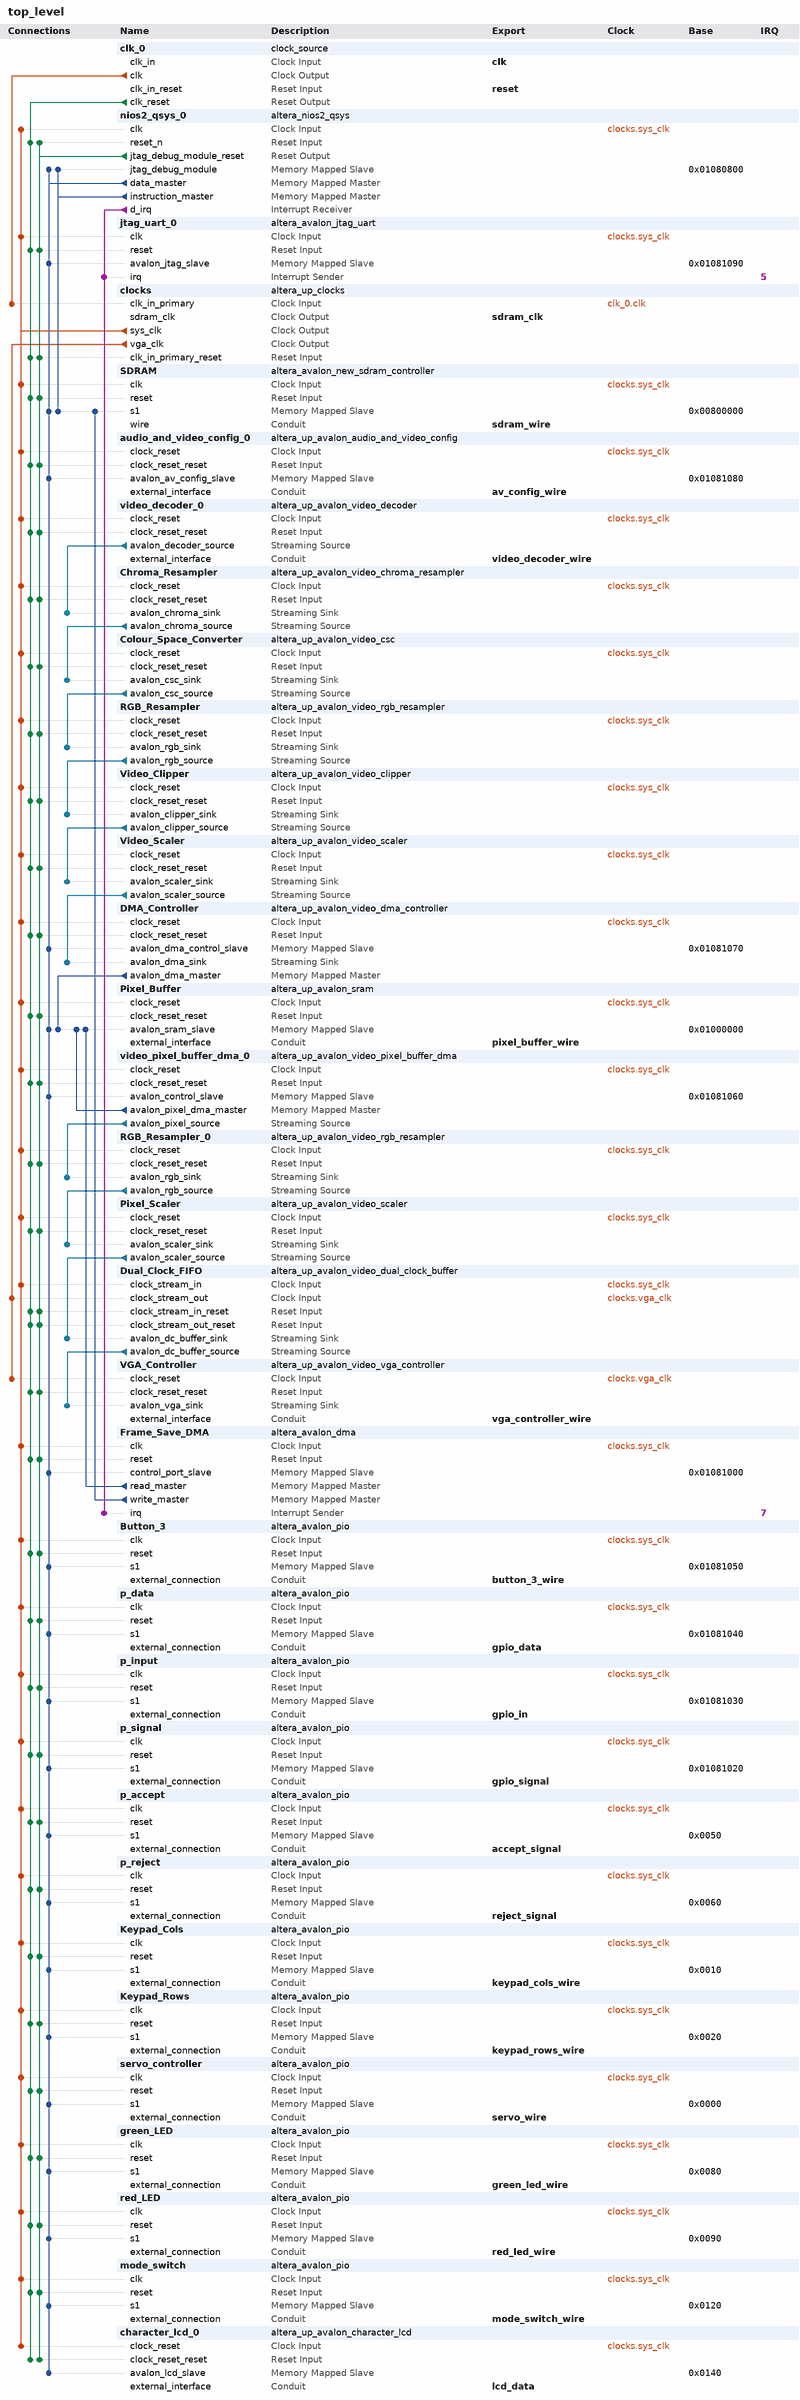
[diagram p0: system contents]
# Platform Designer (Qsys) system top_level, Cyclone II EP2C35F672C6
# Parameters at their usual value, and those the tool derives, are not listed.
package require -exact qsys 13.0
create_system top_level
set_project_property DEVICE_FAMILY {Cyclone II}
set_project_property DEVICE EP2C35F672C6

add_instance clk_0 clock_source 13.0
set_instance_parameter_value clk_0 clockFrequency 50000000

add_instance nios2_qsys_0 altera_nios2_qsys 13.0
set_instance_parameter_value nios2_qsys_0 resetSlave SDRAM.s1
set_instance_parameter_value nios2_qsys_0 mmu_TLBMissExcSlave None
set_instance_parameter_value nios2_qsys_0 exceptionSlave SDRAM.s1
set_instance_parameter_value nios2_qsys_0 breakSlave nios2_qsys_0.jtag_debug_module
set_instance_parameter_value nios2_qsys_0 impl Fast
set_instance_parameter_value nios2_qsys_0 icache_size 4096

add_instance jtag_uart_0 altera_avalon_jtag_uart 13.0.1
set_instance_parameter_value jtag_uart_0 simInteractiveOptions NO_INTERACTIVE_WINDOWS

add_instance clocks altera_up_clocks 13.0
set_instance_parameter_value clocks board DE2
set_instance_parameter_value clocks vga_clk true
set_instance_parameter_value clocks audio_clk false
set_instance_parameter_value clocks audio_clk_freq 12.288

add_instance SDRAM altera_avalon_new_sdram_controller 13.0.1
set_instance_parameter_value SDRAM TAC 5.5
set_instance_parameter_value SDRAM TRCD 20.0
set_instance_parameter_value SDRAM TRP 20.0
set_instance_parameter_value SDRAM casLatency 3
set_instance_parameter_value SDRAM columnWidth 8
set_instance_parameter_value SDRAM dataWidth 16
set_instance_parameter_value SDRAM generateSimulationModel false
set_instance_parameter_value SDRAM model single_Micron_MT48LC4M32B2_7_chip
set_instance_parameter_value SDRAM numberOfBanks 4
set_instance_parameter_value SDRAM numberOfChipSelects 1
set_instance_parameter_value SDRAM powerUpDelay 100.0
set_instance_parameter_value SDRAM refreshPeriod 15.625
set_instance_parameter_value SDRAM rowWidth 12

add_instance audio_and_video_config_0 altera_up_avalon_audio_and_video_config 13.0
set_instance_parameter_value audio_and_video_config_0 board DE2
set_instance_parameter_value audio_and_video_config_0 audio_in {Microphone to ADC}
set_instance_parameter_value audio_and_video_config_0 line_in_bypass false
set_instance_parameter_value audio_and_video_config_0 bit_length 24
set_instance_parameter_value audio_and_video_config_0 sampling_rate {48 kHz}

add_instance video_decoder_0 altera_up_avalon_video_decoder 13.0

add_instance Chroma_Resampler altera_up_avalon_video_chroma_resampler 13.0

add_instance Colour_Space_Converter altera_up_avalon_video_csc 13.0

add_instance RGB_Resampler altera_up_avalon_video_rgb_resampler 13.0
set_instance_parameter_value RGB_Resampler input_type {24-bit RGB}
set_instance_parameter_value RGB_Resampler output_type {16-bit RGB}
set_instance_parameter_value RGB_Resampler alpha 1023

add_instance Video_Clipper altera_up_avalon_video_clipper 13.0
set_instance_parameter_value Video_Clipper color_bits 16
set_instance_parameter_value Video_Clipper color_planes 1

add_instance Video_Scaler altera_up_avalon_video_scaler 13.0
set_instance_parameter_value Video_Scaler width_scaling 0.5
set_instance_parameter_value Video_Scaler height_scaling 1
set_instance_parameter_value Video_Scaler width_in 640
set_instance_parameter_value Video_Scaler color_bits 16
set_instance_parameter_value Video_Scaler color_planes 1

add_instance DMA_Controller altera_up_avalon_video_dma_controller 13.0
set_instance_parameter_value DMA_Controller mode {From Stream to Memory}
set_instance_parameter_value DMA_Controller addr_mode Consecutive
set_instance_parameter_value DMA_Controller start_address 0
set_instance_parameter_value DMA_Controller back_start_address 0
set_instance_parameter_value DMA_Controller width 320
set_instance_parameter_value DMA_Controller height 240
set_instance_parameter_value DMA_Controller color_bits 16
set_instance_parameter_value DMA_Controller color_planes 1
set_instance_parameter_value DMA_Controller dma_enabled true

add_instance Pixel_Buffer altera_up_avalon_sram 13.0
set_instance_parameter_value Pixel_Buffer board DE2
set_instance_parameter_value Pixel_Buffer pixel_buffer true

add_instance video_pixel_buffer_dma_0 altera_up_avalon_video_pixel_buffer_dma 13.0
set_instance_parameter_value video_pixel_buffer_dma_0 addr_mode Consecutive
set_instance_parameter_value video_pixel_buffer_dma_0 start_address 0
set_instance_parameter_value video_pixel_buffer_dma_0 back_start_address 0
set_instance_parameter_value video_pixel_buffer_dma_0 image_width 320
set_instance_parameter_value video_pixel_buffer_dma_0 image_height 240
set_instance_parameter_value video_pixel_buffer_dma_0 color_space {16-bit RGB}

add_instance RGB_Resampler_0 altera_up_avalon_video_rgb_resampler 13.0
set_instance_parameter_value RGB_Resampler_0 input_type {16-bit RGB}
set_instance_parameter_value RGB_Resampler_0 output_type {30-bit RGB}
set_instance_parameter_value RGB_Resampler_0 alpha 1023

add_instance Pixel_Scaler altera_up_avalon_video_scaler 13.0
set_instance_parameter_value Pixel_Scaler width_scaling 2
set_instance_parameter_value Pixel_Scaler height_scaling 2
set_instance_parameter_value Pixel_Scaler width_in 320
set_instance_parameter_value Pixel_Scaler color_bits 10
set_instance_parameter_value Pixel_Scaler color_planes 3

add_instance Dual_Clock_FIFO altera_up_avalon_video_dual_clock_buffer 13.0
set_instance_parameter_value Dual_Clock_FIFO color_bits 10

add_instance VGA_Controller altera_up_avalon_video_vga_controller 13.0
set_instance_parameter_value VGA_Controller board DE2

add_instance Frame_Save_DMA altera_avalon_dma 13.0.1
set_instance_parameter_value Frame_Save_DMA allowByteTransactions true
set_instance_parameter_value Frame_Save_DMA allowDoubleWordTransactions true
set_instance_parameter_value Frame_Save_DMA allowHalfWordTransactions true
set_instance_parameter_value Frame_Save_DMA allowQuadWordTransactions true
set_instance_parameter_value Frame_Save_DMA burstEnable false
set_instance_parameter_value Frame_Save_DMA fifoDepth 32
set_instance_parameter_value Frame_Save_DMA maxBurstSize 128
set_instance_parameter_value Frame_Save_DMA minimumDmaTransactionRegisterWidth 32

add_instance Button_3 altera_avalon_pio 13.0.1
set_instance_parameter_value Button_3 direction Input
set_instance_parameter_value Button_3 width 1

add_instance p_data altera_avalon_pio 13.0.1
set_instance_parameter_value p_data direction Output
set_instance_parameter_value p_data width 8

add_instance p_input altera_avalon_pio 13.0.1
set_instance_parameter_value p_input direction Input
set_instance_parameter_value p_input width 2

add_instance p_signal altera_avalon_pio 13.0.1
set_instance_parameter_value p_signal direction Output
set_instance_parameter_value p_signal width 2

add_instance p_accept altera_avalon_pio 13.0.1
set_instance_parameter_value p_accept direction Input
set_instance_parameter_value p_accept width 1

add_instance p_reject altera_avalon_pio 13.0.1
set_instance_parameter_value p_reject direction Input
set_instance_parameter_value p_reject width 1

add_instance Keypad_Cols altera_avalon_pio 13.0.1
set_instance_parameter_value Keypad_Cols direction Output
set_instance_parameter_value Keypad_Cols width 3

add_instance Keypad_Rows altera_avalon_pio 13.0.1
set_instance_parameter_value Keypad_Rows direction Input
set_instance_parameter_value Keypad_Rows width 4

add_instance servo_controller altera_avalon_pio 13.0.1
set_instance_parameter_value servo_controller direction Output
set_instance_parameter_value servo_controller width 1

add_instance green_LED altera_avalon_pio 13.0.1
set_instance_parameter_value green_LED direction Output
set_instance_parameter_value green_LED width 8

add_instance red_LED altera_avalon_pio 13.0.1
set_instance_parameter_value red_LED direction Output
set_instance_parameter_value red_LED width 18

add_instance mode_switch altera_avalon_pio 13.0.1
set_instance_parameter_value mode_switch direction Input
set_instance_parameter_value mode_switch width 1

add_instance character_lcd_0 altera_up_avalon_character_lcd 13.0
set_instance_parameter_value character_lcd_0 cursor Normal

# connections
add_connection clk_0.clk clocks.clk_in_primary clock
add_connection clocks.sys_clk audio_and_video_config_0.clock_reset clock
add_connection clocks.sys_clk Button_3.clk clock
add_connection clocks.sys_clk character_lcd_0.clock_reset clock
add_connection clocks.sys_clk Chroma_Resampler.clock_reset clock
add_connection clocks.sys_clk Colour_Space_Converter.clock_reset clock
add_connection clocks.sys_clk DMA_Controller.clock_reset clock
add_connection clocks.sys_clk Dual_Clock_FIFO.clock_stream_in clock
add_connection clocks.sys_clk Frame_Save_DMA.clk clock
add_connection clocks.sys_clk green_LED.clk clock
add_connection clocks.sys_clk jtag_uart_0.clk clock
add_connection clocks.sys_clk Keypad_Cols.clk clock
add_connection clocks.sys_clk Keypad_Rows.clk clock
add_connection clocks.sys_clk mode_switch.clk clock
add_connection clocks.sys_clk nios2_qsys_0.clk clock
add_connection clocks.sys_clk p_accept.clk clock
add_connection clocks.sys_clk p_data.clk clock
add_connection clocks.sys_clk p_input.clk clock
add_connection clocks.sys_clk p_reject.clk clock
add_connection clocks.sys_clk p_signal.clk clock
add_connection clocks.sys_clk Pixel_Buffer.clock_reset clock
add_connection clocks.sys_clk Pixel_Scaler.clock_reset clock
add_connection clocks.sys_clk red_LED.clk clock
add_connection clocks.sys_clk RGB_Resampler.clock_reset clock
add_connection clocks.sys_clk RGB_Resampler_0.clock_reset clock
add_connection clocks.sys_clk SDRAM.clk clock
add_connection clocks.sys_clk servo_controller.clk clock
add_connection clocks.sys_clk Video_Clipper.clock_reset clock
add_connection clocks.sys_clk video_decoder_0.clock_reset clock
add_connection clocks.sys_clk video_pixel_buffer_dma_0.clock_reset clock
add_connection clocks.sys_clk Video_Scaler.clock_reset clock
add_connection clocks.vga_clk Dual_Clock_FIFO.clock_stream_out clock
add_connection clocks.vga_clk VGA_Controller.clock_reset clock
add_connection clk_0.clk_reset audio_and_video_config_0.clock_reset_reset reset
add_connection clk_0.clk_reset Button_3.reset reset
add_connection clk_0.clk_reset character_lcd_0.clock_reset_reset reset
add_connection clk_0.clk_reset Chroma_Resampler.clock_reset_reset reset
add_connection clk_0.clk_reset clocks.clk_in_primary_reset reset
add_connection clk_0.clk_reset Colour_Space_Converter.clock_reset_reset reset
add_connection clk_0.clk_reset DMA_Controller.clock_reset_reset reset
add_connection clk_0.clk_reset Dual_Clock_FIFO.clock_stream_in_reset reset
add_connection clk_0.clk_reset Dual_Clock_FIFO.clock_stream_out_reset reset
add_connection clk_0.clk_reset Frame_Save_DMA.reset reset
add_connection clk_0.clk_reset green_LED.reset reset
add_connection clk_0.clk_reset jtag_uart_0.reset reset
add_connection clk_0.clk_reset Keypad_Cols.reset reset
add_connection clk_0.clk_reset Keypad_Rows.reset reset
add_connection clk_0.clk_reset mode_switch.reset reset
add_connection clk_0.clk_reset nios2_qsys_0.reset_n reset
add_connection clk_0.clk_reset p_accept.reset reset
add_connection clk_0.clk_reset p_data.reset reset
add_connection clk_0.clk_reset p_input.reset reset
add_connection clk_0.clk_reset p_reject.reset reset
add_connection clk_0.clk_reset p_signal.reset reset
add_connection clk_0.clk_reset Pixel_Buffer.clock_reset_reset reset
add_connection clk_0.clk_reset Pixel_Scaler.clock_reset_reset reset
add_connection clk_0.clk_reset red_LED.reset reset
add_connection clk_0.clk_reset RGB_Resampler.clock_reset_reset reset
add_connection clk_0.clk_reset RGB_Resampler_0.clock_reset_reset reset
add_connection clk_0.clk_reset SDRAM.reset reset
add_connection clk_0.clk_reset servo_controller.reset reset
add_connection clk_0.clk_reset VGA_Controller.clock_reset_reset reset
add_connection clk_0.clk_reset Video_Clipper.clock_reset_reset reset
add_connection clk_0.clk_reset video_decoder_0.clock_reset_reset reset
add_connection clk_0.clk_reset video_pixel_buffer_dma_0.clock_reset_reset reset
add_connection clk_0.clk_reset Video_Scaler.clock_reset_reset reset
add_connection nios2_qsys_0.jtag_debug_module_reset audio_and_video_config_0.clock_reset_reset reset
add_connection nios2_qsys_0.jtag_debug_module_reset Button_3.reset reset
add_connection nios2_qsys_0.jtag_debug_module_reset character_lcd_0.clock_reset_reset reset
add_connection nios2_qsys_0.jtag_debug_module_reset Chroma_Resampler.clock_reset_reset reset
add_connection nios2_qsys_0.jtag_debug_module_reset clocks.clk_in_primary_reset reset
add_connection nios2_qsys_0.jtag_debug_module_reset Colour_Space_Converter.clock_reset_reset reset
add_connection nios2_qsys_0.jtag_debug_module_reset DMA_Controller.clock_reset_reset reset
add_connection nios2_qsys_0.jtag_debug_module_reset Dual_Clock_FIFO.clock_stream_in_reset reset
add_connection nios2_qsys_0.jtag_debug_module_reset Dual_Clock_FIFO.clock_stream_out_reset reset
add_connection nios2_qsys_0.jtag_debug_module_reset Frame_Save_DMA.reset reset
add_connection nios2_qsys_0.jtag_debug_module_reset green_LED.reset reset
add_connection nios2_qsys_0.jtag_debug_module_reset jtag_uart_0.reset reset
add_connection nios2_qsys_0.jtag_debug_module_reset Keypad_Cols.reset reset
add_connection nios2_qsys_0.jtag_debug_module_reset Keypad_Rows.reset reset
add_connection nios2_qsys_0.jtag_debug_module_reset mode_switch.reset reset
add_connection nios2_qsys_0.jtag_debug_module_reset nios2_qsys_0.reset_n reset
add_connection nios2_qsys_0.jtag_debug_module_reset p_accept.reset reset
add_connection nios2_qsys_0.jtag_debug_module_reset p_data.reset reset
add_connection nios2_qsys_0.jtag_debug_module_reset p_input.reset reset
add_connection nios2_qsys_0.jtag_debug_module_reset p_reject.reset reset
add_connection nios2_qsys_0.jtag_debug_module_reset p_signal.reset reset
add_connection nios2_qsys_0.jtag_debug_module_reset Pixel_Buffer.clock_reset_reset reset
add_connection nios2_qsys_0.jtag_debug_module_reset Pixel_Scaler.clock_reset_reset reset
add_connection nios2_qsys_0.jtag_debug_module_reset red_LED.reset reset
add_connection nios2_qsys_0.jtag_debug_module_reset RGB_Resampler.clock_reset_reset reset
add_connection nios2_qsys_0.jtag_debug_module_reset RGB_Resampler_0.clock_reset_reset reset
add_connection nios2_qsys_0.jtag_debug_module_reset SDRAM.reset reset
add_connection nios2_qsys_0.jtag_debug_module_reset servo_controller.reset reset
add_connection nios2_qsys_0.jtag_debug_module_reset VGA_Controller.clock_reset_reset reset
add_connection nios2_qsys_0.jtag_debug_module_reset Video_Clipper.clock_reset_reset reset
add_connection nios2_qsys_0.jtag_debug_module_reset video_decoder_0.clock_reset_reset reset
add_connection nios2_qsys_0.jtag_debug_module_reset video_pixel_buffer_dma_0.clock_reset_reset reset
add_connection nios2_qsys_0.jtag_debug_module_reset Video_Scaler.clock_reset_reset reset
add_connection DMA_Controller.avalon_dma_master Pixel_Buffer.avalon_sram_slave avalon
set_connection_parameter_value DMA_Controller.avalon_dma_master/Pixel_Buffer.avalon_sram_slave baseAddress 0x01000000
add_connection Frame_Save_DMA.read_master Pixel_Buffer.avalon_sram_slave avalon
set_connection_parameter_value Frame_Save_DMA.read_master/Pixel_Buffer.avalon_sram_slave baseAddress 0x01000000
add_connection Frame_Save_DMA.write_master SDRAM.s1 avalon
set_connection_parameter_value Frame_Save_DMA.write_master/SDRAM.s1 baseAddress 0x00800000
add_connection nios2_qsys_0.data_master audio_and_video_config_0.avalon_av_config_slave avalon
set_connection_parameter_value nios2_qsys_0.data_master/audio_and_video_config_0.avalon_av_config_slave baseAddress 0x01081080
add_connection nios2_qsys_0.data_master Button_3.s1 avalon
set_connection_parameter_value nios2_qsys_0.data_master/Button_3.s1 baseAddress 0x01081050
add_connection nios2_qsys_0.data_master character_lcd_0.avalon_lcd_slave avalon
set_connection_parameter_value nios2_qsys_0.data_master/character_lcd_0.avalon_lcd_slave baseAddress 0x0140
add_connection nios2_qsys_0.data_master DMA_Controller.avalon_dma_control_slave avalon
set_connection_parameter_value nios2_qsys_0.data_master/DMA_Controller.avalon_dma_control_slave baseAddress 0x01081070
add_connection nios2_qsys_0.data_master Frame_Save_DMA.control_port_slave avalon
set_connection_parameter_value nios2_qsys_0.data_master/Frame_Save_DMA.control_port_slave baseAddress 0x01081000
add_connection nios2_qsys_0.data_master green_LED.s1 avalon
set_connection_parameter_value nios2_qsys_0.data_master/green_LED.s1 baseAddress 0x0080
add_connection nios2_qsys_0.data_master jtag_uart_0.avalon_jtag_slave avalon
set_connection_parameter_value nios2_qsys_0.data_master/jtag_uart_0.avalon_jtag_slave baseAddress 0x01081090
add_connection nios2_qsys_0.data_master Keypad_Cols.s1 avalon
set_connection_parameter_value nios2_qsys_0.data_master/Keypad_Cols.s1 baseAddress 0x0010
add_connection nios2_qsys_0.data_master Keypad_Rows.s1 avalon
set_connection_parameter_value nios2_qsys_0.data_master/Keypad_Rows.s1 baseAddress 0x0020
add_connection nios2_qsys_0.data_master mode_switch.s1 avalon
set_connection_parameter_value nios2_qsys_0.data_master/mode_switch.s1 baseAddress 0x0120
add_connection nios2_qsys_0.data_master nios2_qsys_0.jtag_debug_module avalon
set_connection_parameter_value nios2_qsys_0.data_master/nios2_qsys_0.jtag_debug_module baseAddress 0x01080800
add_connection nios2_qsys_0.data_master p_accept.s1 avalon
set_connection_parameter_value nios2_qsys_0.data_master/p_accept.s1 baseAddress 0x0050
add_connection nios2_qsys_0.data_master p_data.s1 avalon
set_connection_parameter_value nios2_qsys_0.data_master/p_data.s1 baseAddress 0x01081040
add_connection nios2_qsys_0.data_master p_input.s1 avalon
set_connection_parameter_value nios2_qsys_0.data_master/p_input.s1 baseAddress 0x01081030
add_connection nios2_qsys_0.data_master p_reject.s1 avalon
set_connection_parameter_value nios2_qsys_0.data_master/p_reject.s1 baseAddress 0x0060
add_connection nios2_qsys_0.data_master p_signal.s1 avalon
set_connection_parameter_value nios2_qsys_0.data_master/p_signal.s1 baseAddress 0x01081020
add_connection nios2_qsys_0.data_master Pixel_Buffer.avalon_sram_slave avalon
set_connection_parameter_value nios2_qsys_0.data_master/Pixel_Buffer.avalon_sram_slave baseAddress 0x01000000
add_connection nios2_qsys_0.data_master red_LED.s1 avalon
set_connection_parameter_value nios2_qsys_0.data_master/red_LED.s1 baseAddress 0x0090
add_connection nios2_qsys_0.data_master SDRAM.s1 avalon
set_connection_parameter_value nios2_qsys_0.data_master/SDRAM.s1 baseAddress 0x00800000
add_connection nios2_qsys_0.data_master servo_controller.s1 avalon
set_connection_parameter_value nios2_qsys_0.data_master/servo_controller.s1 baseAddress 0x0000
add_connection nios2_qsys_0.data_master video_pixel_buffer_dma_0.avalon_control_slave avalon
set_connection_parameter_value nios2_qsys_0.data_master/video_pixel_buffer_dma_0.avalon_control_slave baseAddress 0x01081060
add_connection nios2_qsys_0.instruction_master nios2_qsys_0.jtag_debug_module avalon
set_connection_parameter_value nios2_qsys_0.instruction_master/nios2_qsys_0.jtag_debug_module baseAddress 0x01080800
add_connection nios2_qsys_0.instruction_master SDRAM.s1 avalon
set_connection_parameter_value nios2_qsys_0.instruction_master/SDRAM.s1 baseAddress 0x00800000
add_connection video_pixel_buffer_dma_0.avalon_pixel_dma_master Pixel_Buffer.avalon_sram_slave avalon
set_connection_parameter_value video_pixel_buffer_dma_0.avalon_pixel_dma_master/Pixel_Buffer.avalon_sram_slave baseAddress 0x01000000
add_connection Chroma_Resampler.avalon_chroma_source Colour_Space_Converter.avalon_csc_sink avalon_streaming
add_connection Colour_Space_Converter.avalon_csc_source RGB_Resampler.avalon_rgb_sink avalon_streaming
add_connection Dual_Clock_FIFO.avalon_dc_buffer_source VGA_Controller.avalon_vga_sink avalon_streaming
add_connection Pixel_Scaler.avalon_scaler_source Dual_Clock_FIFO.avalon_dc_buffer_sink avalon_streaming
add_connection RGB_Resampler.avalon_rgb_source Video_Clipper.avalon_clipper_sink avalon_streaming
add_connection RGB_Resampler_0.avalon_rgb_source Pixel_Scaler.avalon_scaler_sink avalon_streaming
add_connection Video_Clipper.avalon_clipper_source Video_Scaler.avalon_scaler_sink avalon_streaming
add_connection video_decoder_0.avalon_decoder_source Chroma_Resampler.avalon_chroma_sink avalon_streaming
add_connection video_pixel_buffer_dma_0.avalon_pixel_source RGB_Resampler_0.avalon_rgb_sink avalon_streaming
add_connection Video_Scaler.avalon_scaler_source DMA_Controller.avalon_dma_sink avalon_streaming
add_connection nios2_qsys_0.d_irq Frame_Save_DMA.irq interrupt
set_connection_parameter_value nios2_qsys_0.d_irq/Frame_Save_DMA.irq irqNumber 7
add_connection nios2_qsys_0.d_irq jtag_uart_0.irq interrupt
set_connection_parameter_value nios2_qsys_0.d_irq/jtag_uart_0.irq irqNumber 5

# exported interfaces
add_interface clk clock sink
set_interface_property clk EXPORT_OF clk_0.clk_in
add_interface reset reset sink
set_interface_property reset EXPORT_OF clk_0.clk_in_reset
add_interface sdram_wire conduit end
set_interface_property sdram_wire EXPORT_OF SDRAM.wire
add_interface av_config_wire conduit end
set_interface_property av_config_wire EXPORT_OF audio_and_video_config_0.external_interface
add_interface video_decoder_wire conduit end
set_interface_property video_decoder_wire EXPORT_OF video_decoder_0.external_interface
add_interface pixel_buffer_wire conduit end
set_interface_property pixel_buffer_wire EXPORT_OF Pixel_Buffer.external_interface
add_interface vga_controller_wire conduit end
set_interface_property vga_controller_wire EXPORT_OF VGA_Controller.external_interface
add_interface sdram_clk clock source
set_interface_property sdram_clk EXPORT_OF clocks.sdram_clk
add_interface button_3_wire conduit end
set_interface_property button_3_wire EXPORT_OF Button_3.external_connection
add_interface gpio_data conduit end
set_interface_property gpio_data EXPORT_OF p_data.external_connection
add_interface gpio_in conduit end
set_interface_property gpio_in EXPORT_OF p_input.external_connection
add_interface gpio_signal conduit end
set_interface_property gpio_signal EXPORT_OF p_signal.external_connection
add_interface keypad_cols_wire conduit end
set_interface_property keypad_cols_wire EXPORT_OF Keypad_Cols.external_connection
add_interface keypad_rows_wire conduit end
set_interface_property keypad_rows_wire EXPORT_OF Keypad_Rows.external_connection
add_interface servo_wire conduit end
set_interface_property servo_wire EXPORT_OF servo_controller.external_connection
add_interface accept_signal conduit end
set_interface_property accept_signal EXPORT_OF p_accept.external_connection
add_interface reject_signal conduit end
set_interface_property reject_signal EXPORT_OF p_reject.external_connection
add_interface green_led_wire conduit end
set_interface_property green_led_wire EXPORT_OF green_LED.external_connection
add_interface red_led_wire conduit end
set_interface_property red_led_wire EXPORT_OF red_LED.external_connection
add_interface mode_switch_wire conduit end
set_interface_property mode_switch_wire EXPORT_OF mode_switch.external_connection
add_interface lcd_data conduit end
set_interface_property lcd_data EXPORT_OF character_lcd_0.external_interface

set_interconnect_requirement {$system} qsys_mm.clockCrossingAdapter HANDSHAKE
set_interconnect_requirement {$system} qsys_mm.maxAdditionalLatency 1

save_system top_level.qsys
